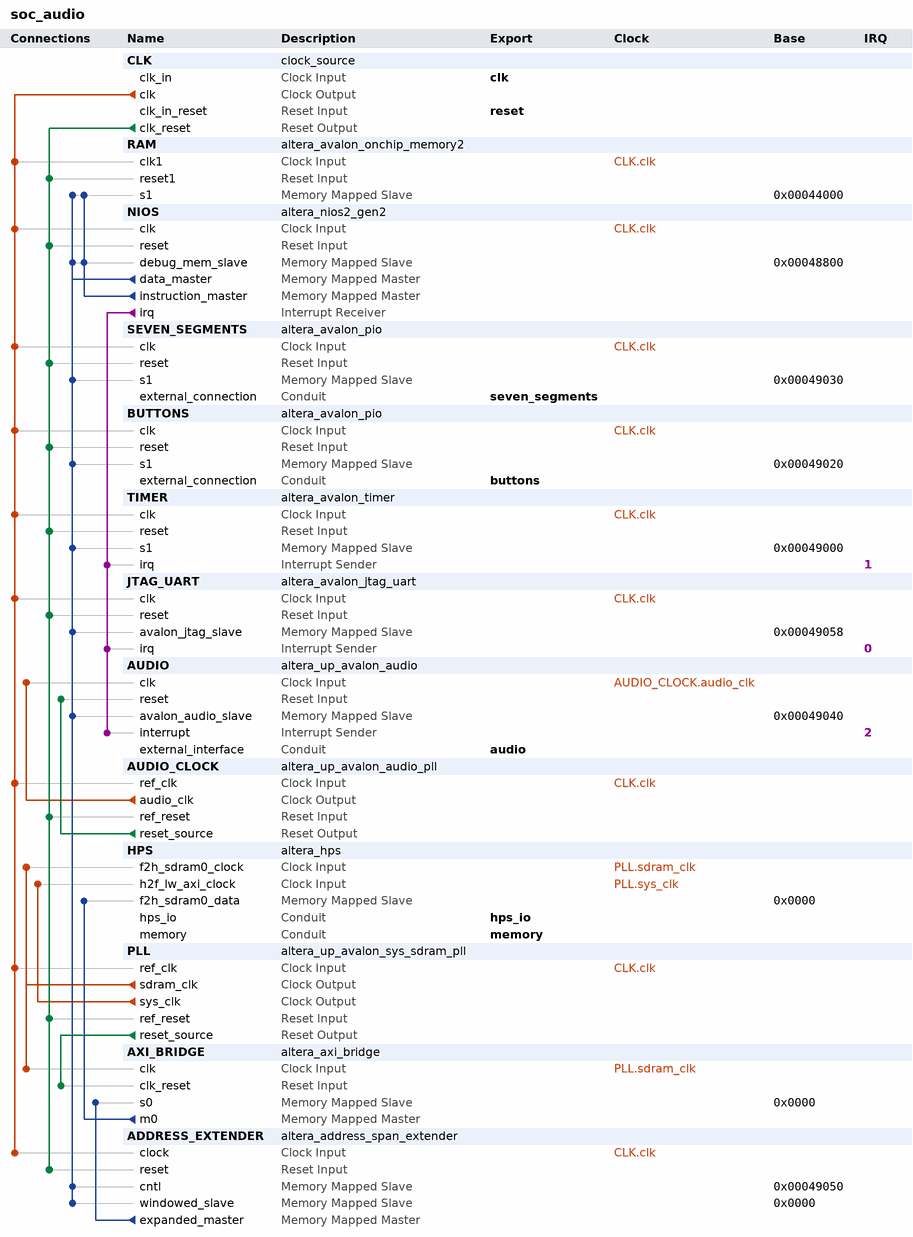
[diagram p0: system contents]
# Platform Designer (Qsys) system soc_audio, Cyclone V 5CSEMA5F31C6
# Parameters at their usual value, and those the tool derives, are not listed.
package require -exact qsys 18.0
create_system soc_audio
set_project_property DEVICE_FAMILY {Cyclone V}
set_project_property DEVICE 5CSEMA5F31C6

add_instance CLK clock_source 18.0
set_instance_parameter_value CLK clockFrequency 50000000

add_instance RAM altera_avalon_onchip_memory2 18.0
set_instance_parameter_value RAM dataWidth 32
set_instance_parameter_value RAM dualPort false
set_instance_parameter_value RAM initMemContent true
set_instance_parameter_value RAM initializationFileName onchip_mem.hex
set_instance_parameter_value RAM memorySize 16384

add_instance NIOS altera_nios2_gen2 18.0
set_instance_parameter_value NIOS dcache_size 2048
set_instance_parameter_value NIOS exceptionSlave RAM.s1
set_instance_parameter_value NIOS icache_size 4096
set_instance_parameter_value NIOS impl Tiny
set_instance_parameter_value NIOS resetSlave RAM.s1

add_instance SEVEN_SEGMENTS altera_avalon_pio 18.0
set_instance_parameter_value SEVEN_SEGMENTS direction Output
set_instance_parameter_value SEVEN_SEGMENTS width 28

add_instance BUTTONS altera_avalon_pio 18.0
set_instance_parameter_value BUTTONS direction Input
set_instance_parameter_value BUTTONS width 4

add_instance TIMER altera_avalon_timer 18.0
set_instance_parameter_value TIMER fixedPeriod true
set_instance_parameter_value TIMER period 1
set_instance_parameter_value TIMER periodUnits MSEC

add_instance JTAG_UART altera_avalon_jtag_uart 18.0
set_instance_parameter_value JTAG_UART simInteractiveOptions NO_INTERACTIVE_WINDOWS

add_instance AUDIO altera_up_avalon_audio 18.0
set_instance_parameter_value AUDIO audio_in false
set_instance_parameter_value AUDIO avalon_bus_type {Memory Mapped}
set_instance_parameter_value AUDIO dw 16

add_instance AUDIO_CLOCK altera_up_avalon_audio_pll 18.0
set_instance_parameter_value AUDIO_CLOCK gui_refclk 50.0

add_instance HPS altera_hps 18.0
set_instance_parameter_value HPS EMAC1_Mode N/A
set_instance_parameter_value HPS EMAC1_PinMuxing Unused
set_instance_parameter_value HPS F2SCLK_COLDRST_Enable false
set_instance_parameter_value HPS F2SCLK_DBGRST_Enable false
set_instance_parameter_value HPS F2SCLK_WARMRST_Enable false
set_instance_parameter_value HPS F2SDRAM_Type AXI-3
set_instance_parameter_value HPS F2SDRAM_Width 64
set_instance_parameter_value HPS F2SINTERRUPT_Enable false
set_instance_parameter_value HPS F2S_Width 0
set_instance_parameter_value HPS FPGA_PERIPHERAL_OUTPUT_CLOCK_FREQ_EMAC0_GTX_CLK 125
set_instance_parameter_value HPS FPGA_PERIPHERAL_OUTPUT_CLOCK_FREQ_EMAC0_MD_CLK 2.5
set_instance_parameter_value HPS FPGA_PERIPHERAL_OUTPUT_CLOCK_FREQ_EMAC1_GTX_CLK 125
set_instance_parameter_value HPS FPGA_PERIPHERAL_OUTPUT_CLOCK_FREQ_EMAC1_MD_CLK 2.5
set_instance_parameter_value HPS HPS_PROTOCOL DDR3
set_instance_parameter_value HPS I2C0_Mode N/A
set_instance_parameter_value HPS I2C0_PinMuxing Unused
set_instance_parameter_value HPS I2C1_Mode N/A
set_instance_parameter_value HPS I2C1_PinMuxing Unused
set_instance_parameter_value HPS LWH2F_Enable true
set_instance_parameter_value HPS MEM_BANKADDR_WIDTH 3
set_instance_parameter_value HPS MEM_CLK_FREQ 400.0
set_instance_parameter_value HPS MEM_CLK_FREQ_MAX 400.0
set_instance_parameter_value HPS MEM_COL_ADDR_WIDTH 8
set_instance_parameter_value HPS MEM_DQ_WIDTH 32
set_instance_parameter_value HPS MEM_DRV_STR RZQ/6
set_instance_parameter_value HPS MEM_ROW_ADDR_WIDTH 12
set_instance_parameter_value HPS MEM_RTT_NOM RZQ/4
set_instance_parameter_value HPS MEM_RTT_WR {Dynamic ODT off}
set_instance_parameter_value HPS MEM_TCL 7
set_instance_parameter_value HPS MEM_TFAW_NS 37.5
set_instance_parameter_value HPS MEM_TINIT_US 499
set_instance_parameter_value HPS MEM_TMRD_CK 3
set_instance_parameter_value HPS MEM_TRAS_NS 40.0
set_instance_parameter_value HPS MEM_TRCD_NS 15.0
set_instance_parameter_value HPS MEM_TREFI_US 7.0
set_instance_parameter_value HPS MEM_TRFC_NS 75.0
set_instance_parameter_value HPS MEM_TRP_NS 15.0
set_instance_parameter_value HPS MEM_TWTR 2
set_instance_parameter_value HPS MEM_VENDOR Micron
set_instance_parameter_value HPS MEM_WTCL 6
set_instance_parameter_value HPS QSPI_Mode N/A
set_instance_parameter_value HPS QSPI_PinMuxing Unused
set_instance_parameter_value HPS REF_CLK_FREQ 25.0
set_instance_parameter_value HPS S2FCLK_USER2CLK 5
set_instance_parameter_value HPS S2F_Width 0
set_instance_parameter_value HPS SDIO_Mode {4-bit Data}
set_instance_parameter_value HPS SDIO_PinMuxing {HPS I/O Set 0}
set_instance_parameter_value HPS SPIM1_Mode N/A
set_instance_parameter_value HPS SPIM1_PinMuxing Unused
set_instance_parameter_value HPS STM_Enable false
set_instance_parameter_value HPS TIMING_BOARD_AC_SKEW 0.02
set_instance_parameter_value HPS TIMING_BOARD_AC_TO_CK_SKEW 0.0
set_instance_parameter_value HPS TIMING_BOARD_DQ_TO_DQS_SKEW 0.0
set_instance_parameter_value HPS TIMING_BOARD_MAX_CK_DELAY 0.6
set_instance_parameter_value HPS TIMING_BOARD_MAX_DQS_DELAY 0.6
set_instance_parameter_value HPS TIMING_BOARD_SKEW_BETWEEN_DQS 0.02
set_instance_parameter_value HPS TIMING_BOARD_SKEW_CKDQS_DIMM_MAX 0.01
set_instance_parameter_value HPS TIMING_BOARD_SKEW_CKDQS_DIMM_MIN -0.01
set_instance_parameter_value HPS TIMING_BOARD_SKEW_WITHIN_DQS 0.02
set_instance_parameter_value HPS TIMING_TDH 125
set_instance_parameter_value HPS TIMING_TDQSCK 400
set_instance_parameter_value HPS TIMING_TDQSQ 120
set_instance_parameter_value HPS TIMING_TDS 50
set_instance_parameter_value HPS TIMING_TIH 250
set_instance_parameter_value HPS TIMING_TIS 175
set_instance_parameter_value HPS TIMING_TQSH 0.38
set_instance_parameter_value HPS UART0_Mode {Flow Control}
set_instance_parameter_value HPS UART0_PinMuxing {HPS I/O Set 0}
set_instance_parameter_value HPS USB1_Mode N/A
set_instance_parameter_value HPS USB1_PinMuxing Unused
set_instance_parameter_value HPS desired_cfg_clk_mhz 100.0
set_instance_parameter_value HPS desired_qspi_clk_mhz 400.0

add_instance PLL altera_up_avalon_sys_sdram_pll 18.0
set_instance_parameter_value PLL CV_boards DE10-Standard
set_instance_parameter_value PLL gui_outclk 100.0
set_instance_parameter_value PLL gui_refclk 50.0

add_instance AXI_BRIDGE altera_axi_bridge 18.0
set_instance_parameter_value AXI_BRIDGE ADDR_WIDTH 32
set_instance_parameter_value AXI_BRIDGE AXI_VERSION AXI3
set_instance_parameter_value AXI_BRIDGE COMBINED_ACCEPTANCE_CAPABILITY 16
set_instance_parameter_value AXI_BRIDGE COMBINED_ISSUING_CAPABILITY 16
set_instance_parameter_value AXI_BRIDGE DATA_WIDTH 64
set_instance_parameter_value AXI_BRIDGE M0_ID_WIDTH 8
set_instance_parameter_value AXI_BRIDGE READ_ACCEPTANCE_CAPABILITY 16
set_instance_parameter_value AXI_BRIDGE READ_ADDR_USER_WIDTH 64
set_instance_parameter_value AXI_BRIDGE READ_DATA_REORDERING_DEPTH 1
set_instance_parameter_value AXI_BRIDGE READ_DATA_USER_WIDTH 64
set_instance_parameter_value AXI_BRIDGE READ_ISSUING_CAPABILITY 16
set_instance_parameter_value AXI_BRIDGE S0_ID_WIDTH 8
set_instance_parameter_value AXI_BRIDGE USE_M0_ARBURST 1
set_instance_parameter_value AXI_BRIDGE USE_M0_ARCACHE 1
set_instance_parameter_value AXI_BRIDGE USE_M0_ARID 1
set_instance_parameter_value AXI_BRIDGE USE_M0_ARLEN 1
set_instance_parameter_value AXI_BRIDGE USE_M0_ARLOCK 1
set_instance_parameter_value AXI_BRIDGE USE_M0_ARQOS 1
set_instance_parameter_value AXI_BRIDGE USE_M0_ARREGION 1
set_instance_parameter_value AXI_BRIDGE USE_M0_ARSIZE 1
set_instance_parameter_value AXI_BRIDGE USE_M0_ARUSER 0
set_instance_parameter_value AXI_BRIDGE USE_M0_AWBURST 1
set_instance_parameter_value AXI_BRIDGE USE_M0_AWCACHE 1
set_instance_parameter_value AXI_BRIDGE USE_M0_AWID 1
set_instance_parameter_value AXI_BRIDGE USE_M0_AWLEN 1
set_instance_parameter_value AXI_BRIDGE USE_M0_AWLOCK 1
set_instance_parameter_value AXI_BRIDGE USE_M0_AWQOS 1
set_instance_parameter_value AXI_BRIDGE USE_M0_AWREGION 1
set_instance_parameter_value AXI_BRIDGE USE_M0_AWSIZE 1
set_instance_parameter_value AXI_BRIDGE USE_M0_AWUSER 0
set_instance_parameter_value AXI_BRIDGE USE_M0_BID 1
set_instance_parameter_value AXI_BRIDGE USE_M0_BRESP 1
set_instance_parameter_value AXI_BRIDGE USE_M0_BUSER 0
set_instance_parameter_value AXI_BRIDGE USE_M0_RID 1
set_instance_parameter_value AXI_BRIDGE USE_M0_RLAST 1
set_instance_parameter_value AXI_BRIDGE USE_M0_RRESP 1
set_instance_parameter_value AXI_BRIDGE USE_M0_RUSER 0
set_instance_parameter_value AXI_BRIDGE USE_M0_WSTRB 1
set_instance_parameter_value AXI_BRIDGE USE_M0_WUSER 0
set_instance_parameter_value AXI_BRIDGE USE_PIPELINE 1
set_instance_parameter_value AXI_BRIDGE USE_S0_ARCACHE 1
set_instance_parameter_value AXI_BRIDGE USE_S0_ARLOCK 1
set_instance_parameter_value AXI_BRIDGE USE_S0_ARPROT 1
set_instance_parameter_value AXI_BRIDGE USE_S0_ARQOS 1
set_instance_parameter_value AXI_BRIDGE USE_S0_ARREGION 1
set_instance_parameter_value AXI_BRIDGE USE_S0_ARUSER 0
set_instance_parameter_value AXI_BRIDGE USE_S0_AWCACHE 1
set_instance_parameter_value AXI_BRIDGE USE_S0_AWLOCK 1
set_instance_parameter_value AXI_BRIDGE USE_S0_AWPROT 1
set_instance_parameter_value AXI_BRIDGE USE_S0_AWQOS 1
set_instance_parameter_value AXI_BRIDGE USE_S0_AWREGION 1
set_instance_parameter_value AXI_BRIDGE USE_S0_AWUSER 0
set_instance_parameter_value AXI_BRIDGE USE_S0_BRESP 1
set_instance_parameter_value AXI_BRIDGE USE_S0_BUSER 0
set_instance_parameter_value AXI_BRIDGE USE_S0_RRESP 1
set_instance_parameter_value AXI_BRIDGE USE_S0_RUSER 0
set_instance_parameter_value AXI_BRIDGE USE_S0_WLAST 1
set_instance_parameter_value AXI_BRIDGE USE_S0_WUSER 0
set_instance_parameter_value AXI_BRIDGE WRITE_ACCEPTANCE_CAPABILITY 16
set_instance_parameter_value AXI_BRIDGE WRITE_ADDR_USER_WIDTH 64
set_instance_parameter_value AXI_BRIDGE WRITE_DATA_USER_WIDTH 64
set_instance_parameter_value AXI_BRIDGE WRITE_ISSUING_CAPABILITY 16
set_instance_parameter_value AXI_BRIDGE WRITE_RESP_USER_WIDTH 64

add_instance ADDRESS_EXTENDER altera_address_span_extender 18.0
set_instance_parameter_value ADDRESS_EXTENDER BURSTCOUNT_WIDTH 1
set_instance_parameter_value ADDRESS_EXTENDER DATA_WIDTH 32
set_instance_parameter_value ADDRESS_EXTENDER ENABLE_SLAVE_PORT true
set_instance_parameter_value ADDRESS_EXTENDER MASTER_ADDRESS_DEF 0
set_instance_parameter_value ADDRESS_EXTENDER MAX_PENDING_READS 1
set_instance_parameter_value ADDRESS_EXTENDER SLAVE_ADDRESS_WIDTH 16

# connections
add_connection AUDIO_CLOCK.audio_clk AUDIO.clk clock
add_connection CLK.clk ADDRESS_EXTENDER.clock clock
add_connection CLK.clk AUDIO_CLOCK.ref_clk clock
add_connection CLK.clk BUTTONS.clk clock
add_connection CLK.clk JTAG_UART.clk clock
add_connection CLK.clk NIOS.clk clock
add_connection CLK.clk PLL.ref_clk clock
add_connection CLK.clk RAM.clk1 clock
add_connection CLK.clk SEVEN_SEGMENTS.clk clock
add_connection CLK.clk TIMER.clk clock
add_connection PLL.sdram_clk AXI_BRIDGE.clk clock
add_connection PLL.sdram_clk HPS.f2h_sdram0_clock clock
add_connection PLL.sys_clk HPS.h2f_lw_axi_clock clock
add_connection AUDIO_CLOCK.reset_source AUDIO.reset reset
add_connection CLK.clk_reset ADDRESS_EXTENDER.reset reset
add_connection CLK.clk_reset AUDIO_CLOCK.ref_reset reset
add_connection CLK.clk_reset BUTTONS.reset reset
add_connection CLK.clk_reset JTAG_UART.reset reset
add_connection CLK.clk_reset NIOS.reset reset
add_connection CLK.clk_reset PLL.ref_reset reset
add_connection CLK.clk_reset RAM.reset1 reset
add_connection CLK.clk_reset SEVEN_SEGMENTS.reset reset
add_connection CLK.clk_reset TIMER.reset reset
add_connection PLL.reset_source AXI_BRIDGE.clk_reset reset
add_connection ADDRESS_EXTENDER.expanded_master AXI_BRIDGE.s0 avalon
set_connection_parameter_value ADDRESS_EXTENDER.expanded_master/AXI_BRIDGE.s0 baseAddress 0x0000
add_connection AXI_BRIDGE.m0 HPS.f2h_sdram0_data avalon
set_connection_parameter_value AXI_BRIDGE.m0/HPS.f2h_sdram0_data baseAddress 0x0000
add_connection NIOS.data_master ADDRESS_EXTENDER.cntl avalon
set_connection_parameter_value NIOS.data_master/ADDRESS_EXTENDER.cntl baseAddress 0x00049050
add_connection NIOS.data_master ADDRESS_EXTENDER.windowed_slave avalon
set_connection_parameter_value NIOS.data_master/ADDRESS_EXTENDER.windowed_slave baseAddress 0x0000
add_connection NIOS.data_master AUDIO.avalon_audio_slave avalon
set_connection_parameter_value NIOS.data_master/AUDIO.avalon_audio_slave baseAddress 0x00049040
add_connection NIOS.data_master BUTTONS.s1 avalon
set_connection_parameter_value NIOS.data_master/BUTTONS.s1 baseAddress 0x00049020
add_connection NIOS.data_master JTAG_UART.avalon_jtag_slave avalon
set_connection_parameter_value NIOS.data_master/JTAG_UART.avalon_jtag_slave baseAddress 0x00049058
add_connection NIOS.data_master NIOS.debug_mem_slave avalon
set_connection_parameter_value NIOS.data_master/NIOS.debug_mem_slave baseAddress 0x00048800
add_connection NIOS.data_master RAM.s1 avalon
set_connection_parameter_value NIOS.data_master/RAM.s1 baseAddress 0x00044000
add_connection NIOS.data_master SEVEN_SEGMENTS.s1 avalon
set_connection_parameter_value NIOS.data_master/SEVEN_SEGMENTS.s1 baseAddress 0x00049030
add_connection NIOS.data_master TIMER.s1 avalon
set_connection_parameter_value NIOS.data_master/TIMER.s1 baseAddress 0x00049000
add_connection NIOS.instruction_master NIOS.debug_mem_slave avalon
set_connection_parameter_value NIOS.instruction_master/NIOS.debug_mem_slave baseAddress 0x00048800
add_connection NIOS.instruction_master RAM.s1 avalon
set_connection_parameter_value NIOS.instruction_master/RAM.s1 baseAddress 0x00044000
add_connection NIOS.irq AUDIO.interrupt interrupt
set_connection_parameter_value NIOS.irq/AUDIO.interrupt irqNumber 2
add_connection NIOS.irq JTAG_UART.irq interrupt
set_connection_parameter_value NIOS.irq/JTAG_UART.irq irqNumber 0
add_connection NIOS.irq TIMER.irq interrupt
set_connection_parameter_value NIOS.irq/TIMER.irq irqNumber 1

# exported interfaces
add_interface audio conduit end
set_interface_property audio EXPORT_OF AUDIO.external_interface
add_interface buttons conduit end
set_interface_property buttons EXPORT_OF BUTTONS.external_connection
add_interface clk clock sink
set_interface_property clk EXPORT_OF CLK.clk_in
add_interface hps_io conduit end
set_interface_property hps_io EXPORT_OF HPS.hps_io
add_interface memory conduit end
set_interface_property memory EXPORT_OF HPS.memory
add_interface reset reset sink
set_interface_property reset EXPORT_OF CLK.clk_in_reset
add_interface seven_segments conduit end
set_interface_property seven_segments EXPORT_OF SEVEN_SEGMENTS.external_connection

set_interconnect_requirement {$system} qsys_mm.clockCrossingAdapter HANDSHAKE
set_interconnect_requirement {$system} qsys_mm.enableEccProtection FALSE
set_interconnect_requirement {$system} qsys_mm.insertDefaultSlave FALSE
set_interconnect_requirement {$system} qsys_mm.maxAdditionalLatency 1

save_system soc_audio.qsys
